# EAGLE design D1 Breakout - LCD SMD Dupont (EAGLE 7.3.0)
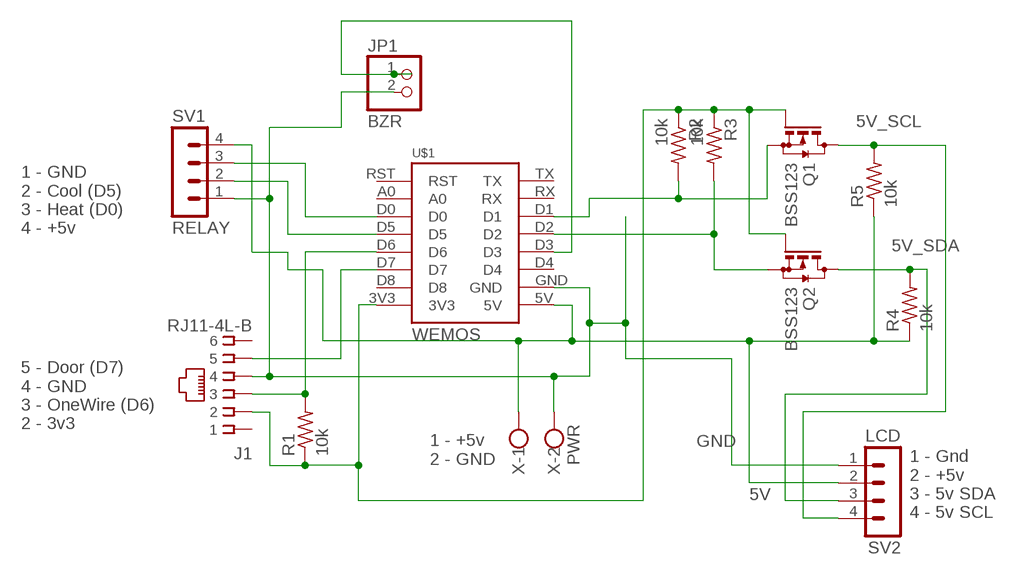
[diagram p0: schematic, sheet 1]

## Parts
J1  RJ11-4L-B  [RJ11-NO_SHIELD]
JP1  BZR  PINHD-1X2  [1X02]
Q1  BSS123  [SOT23]
Q2  BSS123  [SOT23]
R1  10k  R-US_R0805  [R0805]
R2  10k  R-US_R0805  [R0805]
R3  10k  R-US_R0805  [R0805]
R4  10k  R-US_R0805  [R0805]
R5  10k  R-US_R0805  [R0805]
SV1  RELAY  MA04-1  [MA04-1]
SV2  LCD  MA04-1  [MA04-1]
U$1  WEMOS  [WEMOS]
X  PWR  W237-102  [W237-102]

## Nets
3V3_SCL: Q1.2(S) R2.2 U$1.D1
3V3_SDA: Q2.2(S) R3.2 U$1.D2
5V [5v]: R4.1 R5.1 SV1.4 SV2.2 U$1.5V X.1
5V_SCL: Q1.3(D) R5.2 SV2.4
5V_SDA: Q2.3(D) R4.2 SV2.3
D6: J1.3 R1.2 U$1.D6
D7: J1.5 U$1.D7
GND [Gnd]: J1.4 JP1.2 SV1.1 SV2.1 U$1.GND X.2
N$3 [3v]: J1.2 Q1.1(G) Q2.1(G) R1.1 R2.1 R3.1 U$1.3V3
N$6: JP1.1 U$1.D3
N$7: SV1.2 U$1.D5
N$8: SV1.3 U$1.D0
Unconnected: J1.1 J1.6 U$1.A0 U$1.D4 U$1.D8 U$1.RST U$1.RX U$1.TX

## Notes on the sheet
- 1 - GND
  2 - Cool (D5)
  3 - Heat (D0)
  4 - +5v
- 5 - Door (D7)
  4 - GND
  3 - OneWire (D6) 
  2 - 3v3
- 1 - +5v
  2 - GND
- 1 - Gnd
  2 - +5v
  3 - 5v SDA
  4 - 5v SCL

## Library data of the parts
J1 = con-tycoelectronics:RJ11: CORCOM Modular RJ Jacks No Shield Source: www.tycoelectronics.com .. ENG_DS_1654001_1099_RJ_L_0507.pdf; MF: TYCO ELECTRONICS; MPN: RJ11-4L-B; OC_FARNELL: unknown; OC_NEWARK: 52K3315
JP1 = pinhead:PINHD-1X2: PIN HEADER
Q1 Q2 = transistor-small-signal:BSS123: N-CHANNEL MOS FET
R1-R5 = rcl:R-US_: RESISTOR, American symbol
SV1 SV2 = con-lstb:MA04-1: PIN HEADER; OC_FARNELL: unknown; OC_NEWARK: unknown
U$1 = 1455413453956-wemos:WEMOS
X = con-wago-500:W237-102: WAGO SCREW CLAMP; MPN: 237-102; OC_FARNELL: unknown; OC_NEWARK: 70K9898

## Net classes
0 default: width 0.305 mm, clearance 0.305 mm
1 5v: width 0.406 mm, clearance 0.406 mm
2 3v: width 0.406 mm, clearance 0.406 mm
3 Gnd: width 0.406 mm, clearance 0.406 mm

## Board
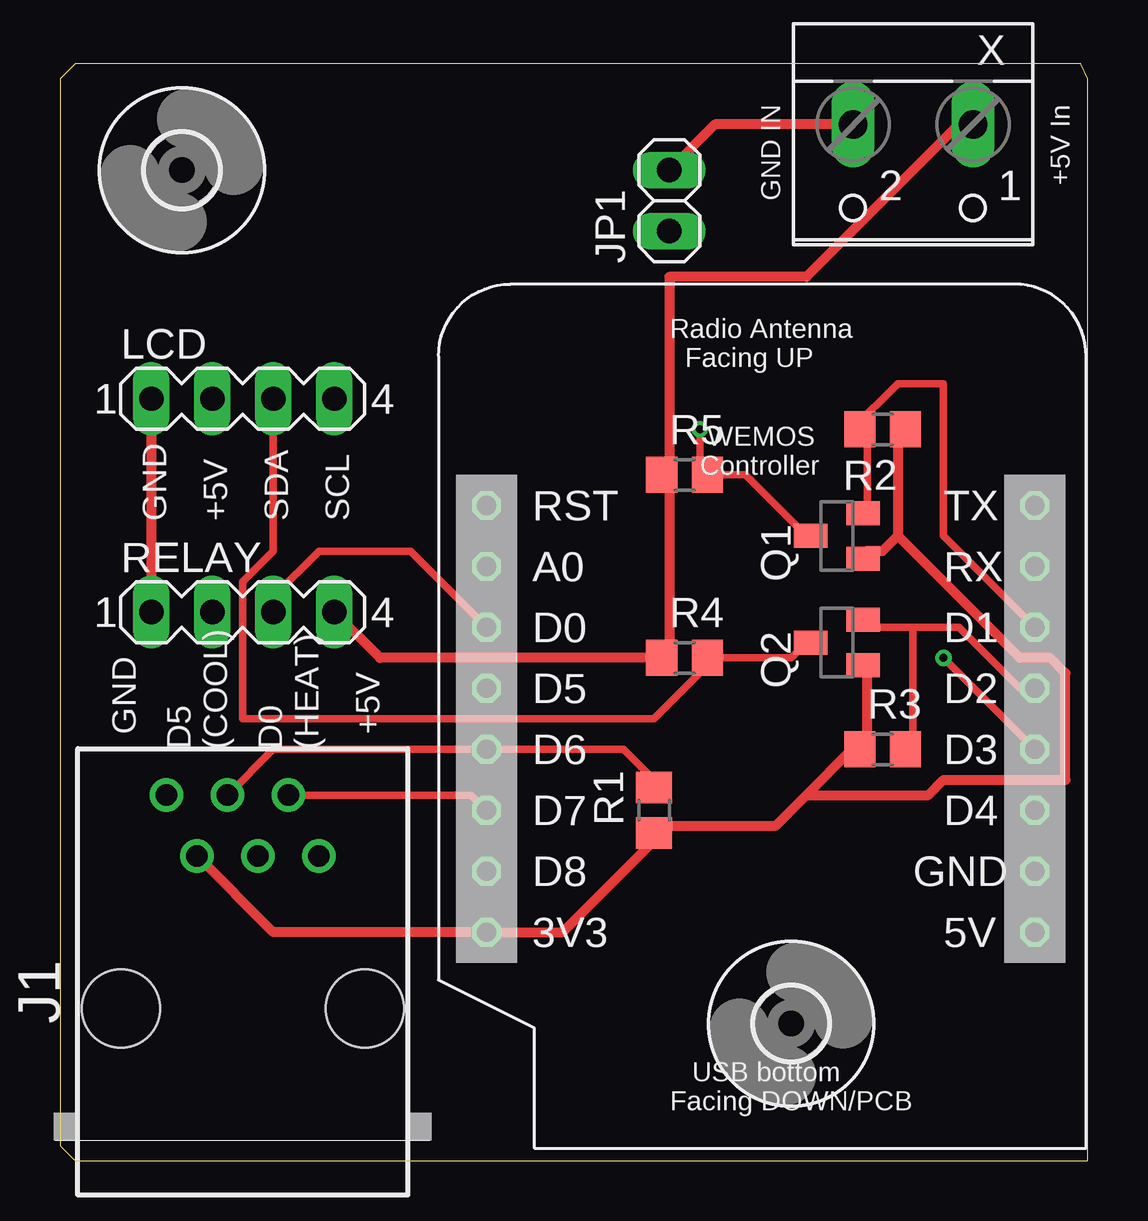
[diagram p1: board, top side]
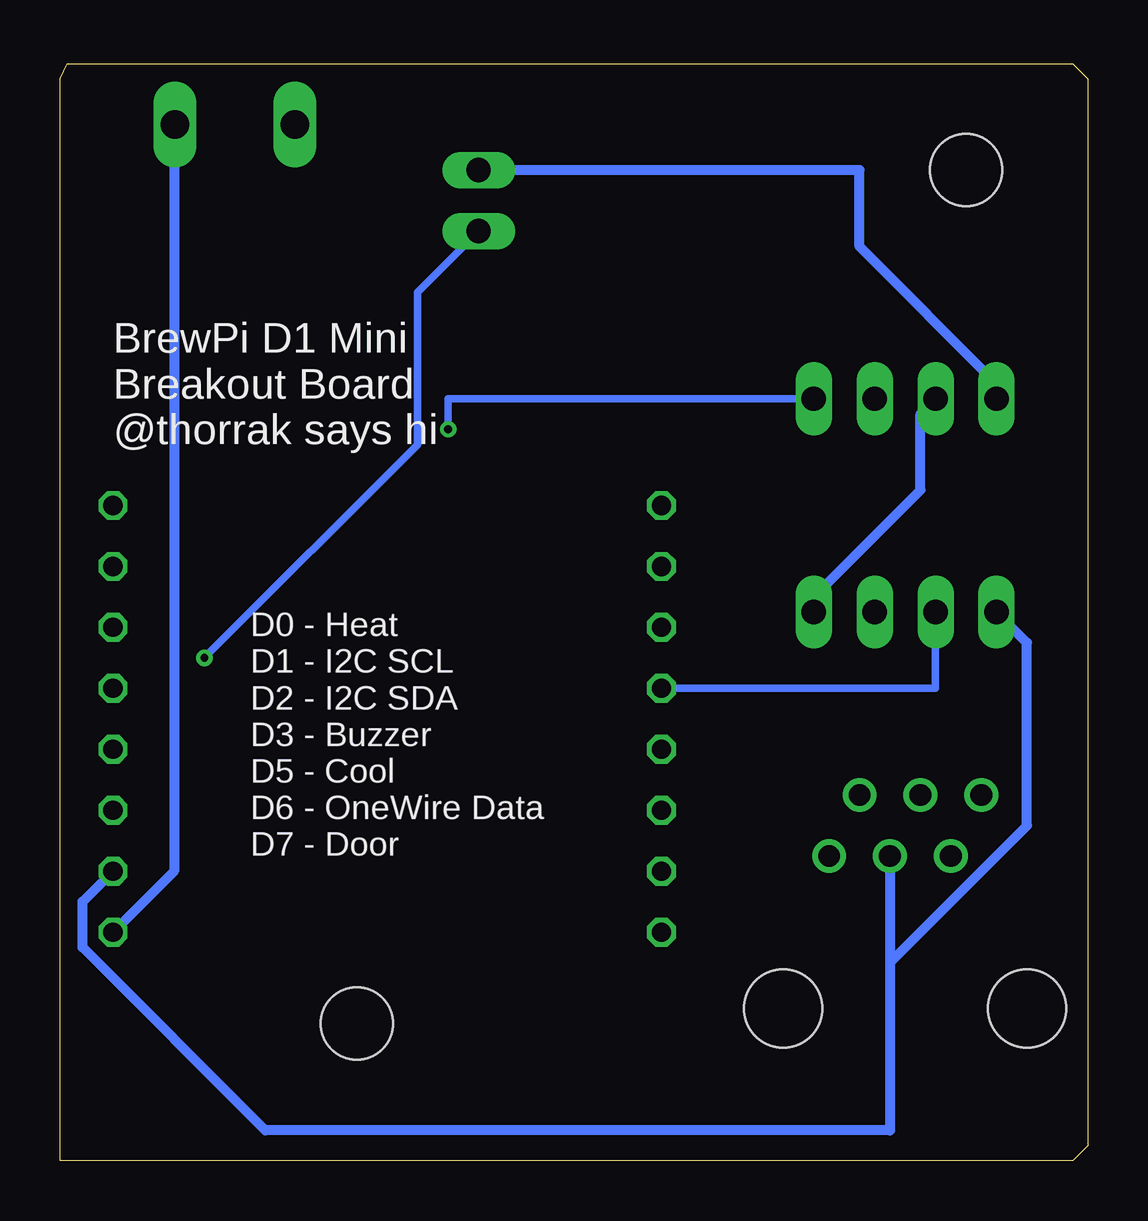
[diagram p2: board, bottom side, seen from below]

Size 42.85 x 45.72 mm. Coordinates in mm from the lower left corner, seen from the top.
Outline: 0,0.64 0.63,0 42.85,0 42.85,45.08 42.55,45.71 40.64,45.72 0.63,45.72 0,45.08 0,0.64
Copper layers (1*16): Top 0.0356mm / dielectric 1.5011mm / Bottom 0.0356mm
Design rules "PCBs_io": minimum track width 6mil, minimum drill 13mil, track to track 6mil, track to pad 6mil, pad to pad 6mil, via to via 6mil, smd to smd 6mil, copper to edge 15mil, drill to drill 6mil, minimum pad ring 7mil, minimum via ring 7mil, stop-mask expansion 3mil, vias tented up to drill 0mil, thermal gap 10mil

### Footprints (pad centres in the part's own frame; a part is rotated, then mirrored left to right if it is on the bottom)
RJ11-NO_SHIELD = drill 0.9 pad 1.4: 1 -3.175,8.89; 2 -1.905,6.35; 3 -0.635,8.89; 4 0.635,6.35; 5 1.905,8.89; 6 3.175,6.35 | hole 3.251: -5.08,0; 5.08,0
1X02 = drill 1.016 long: 1 -1.27,0; 2 1.27,0
SOT23 = smd 1 x 1.4: 1 -0.95,-1.1; 2 0.95,-1.1; 3 0,1.1
R0805 = smd 1.3 x 1.5: 1 -0.95,0; 2 0.95,0
MA04-1 = drill 1.016 long: 1 -3.81,0; 2 -1.27,0; 3 1.27,0; 4 3.81,0
WEMOS = drill 0.8 octagon: 3V3 0,0; 5V 22.86,0; A0 0,15.24; D0 0,12.7; D1 22.86,12.7; D2 22.86,10.16; D3 22.86,7.62; D4 22.86,5.08; D5 0,10.16; D6 0,7.62; D7 0,5.08; D8 0,2.54; GND 22.86,2.54; RST 0,17.78; RX 22.86,15.24; TX 22.86,17.78
3,0 = hole 3: 0,0
W237-102 = drill 1.194 long: 1 -2.5,-1.27; 2 2.5,-1.27

### Placement (x,y rotation side)
J1  7.62,6.35 0 top
JP1  25.4,40 90 top
Q1  32.39,26.04 90 top
Q2  32.39,21.59 90 top
R1  24.77,14.61 90 top
R2  34.29,30.48 180 top
R3  34.29,17.14 0 top
R4  26.03,20.96 0 top
R5  26.03,28.57 0 top
SV1  7.62,22.86 0 top
SV2  7.62,31.75 0 top
U$1  17.78,9.53 0 top
U$2  [3,0]  5.08,41.27 0 top
U$4  [3,0]  30.48,5.71 0 top
X  35.56,41.91 180 top

### Tracks (layer width: path | path; a pad name or v marks a point on that pad's centre or on a via)
3V3_SCL
  Top 0.305: Q1.2 33.66,27.31 33.66,30.48 R2.2 33.02,30.48 34.92,32.39 36.83,32.39 36.83,26.04 U$1.D1
3V3_SDA
  Top 0.305: 35.56,22.22 37.47,22.22 40,19.68 U$1.D2 | 35.56,22.22 33.66,22.22 Q2.2 | 35.56,22.22 35.56,17.14 R3.2
5V
  Top 0.406: 25.4,28.57 25.4,20.96 R4.1 13.34,20.96 SV1.4 | 25.4,28.57 25.4,36.83 31.11,36.83 37.47,43.18 X.1 | 25.4,28.57 R5.1
  Bottom 0.406: SV2.2 6.98,31.11 6.98,27.94 11.43,23.5 SV1.4 | U$1.5V 38.1,12.07 38.1,43.18 X.1
5V_SCL  (via drill 0.33)
  Top 0.305: Q1.3 31.11,26.04 28.58,28.57 R5.2 26.67,28.57 v26.67,30.48
  Bottom 0.305: SV2.4 26.67,31.75 v26.67,30.48
5V_SDA
  Top 0.305: 27.3,20.96 30.48,20.96 31.11,21.59 Q2.3 | SV2.3 8.89,25.4 7.62,24.13 7.62,18.42 24.77,18.42 27.3,20.96 | 27.3,20.96 R4.2
D6
  Top 0.305: R1.2 24.77,15.88 23.5,17.14 U$1.D6 8.89,17.14 J1.3
D7
  Top 0.305: U$1.D7 17.14,15.24 J1.5
GND
  Top 0.406: JP1.2 27.3,43.18 X.2 | SV2.1 SV1.1
  Bottom 0.406: U$1.GND 41.91,10.79 41.91,8.89 34.29,1.27 8.26,1.27 8.26,8.25 | J1.4 8.26,8.25 | SV1.1 2.54,21.59 2.54,13.97 8.26,8.25 | JP1.2 9.52,41.27 9.52,38.1 3.81,32.39 SV2.1
N$3
  Top 0.406: 34.92,26.04 34.29,25.4 33.66,25.4 Q1.1 | 34.92,26.04 34.92,30.48 R2.1 | Q2.1 33.66,20.32 33.66,17.14 R3.1 33.02,17.14 31.11,15.24 | 31.11,15.24 29.84,13.97 24.77,13.97 R1.1 24.77,13.33 20.95,9.53 U$1.3V3 8.89,9.53 J1.2 | 34.92,26.04 40,20.96 41.28,20.96 41.91,20.32 41.91,15.88 36.83,15.88 36.19,15.24 31.11,15.24
N$6  (via drill 0.33)
  Top 0.305: v36.83,20.96 U$1.D3
  Bottom 0.305: v36.83,20.96 27.94,29.85 27.94,36.19 JP1.1
N$7
  Bottom 0.305: U$1.D5 6.35,19.68 SV1.2
N$8
  Top 0.305: U$1.D0 14.6,25.4 10.8,25.4 8.89,23.5 SV1.3

### Text on the board
tPlace: GND IN | +5V In | GND | +5V | SDA | SCL | GND | D5 / (COOL) | D0 / (HEAT) | +5V
bNames: BrewPi D1 Mini / Breakout Board / @thorrak says hi | D0 - Heat / D1 - I2C SCL / D2 - I2C SDA / D3 - Buzzer / D5 - Cool / D6 - OneWire Data / D7 - Door